# EAGLE schematic BeJeweled-v10 (EAGLE 5.04)

## Sheet 1 of 4
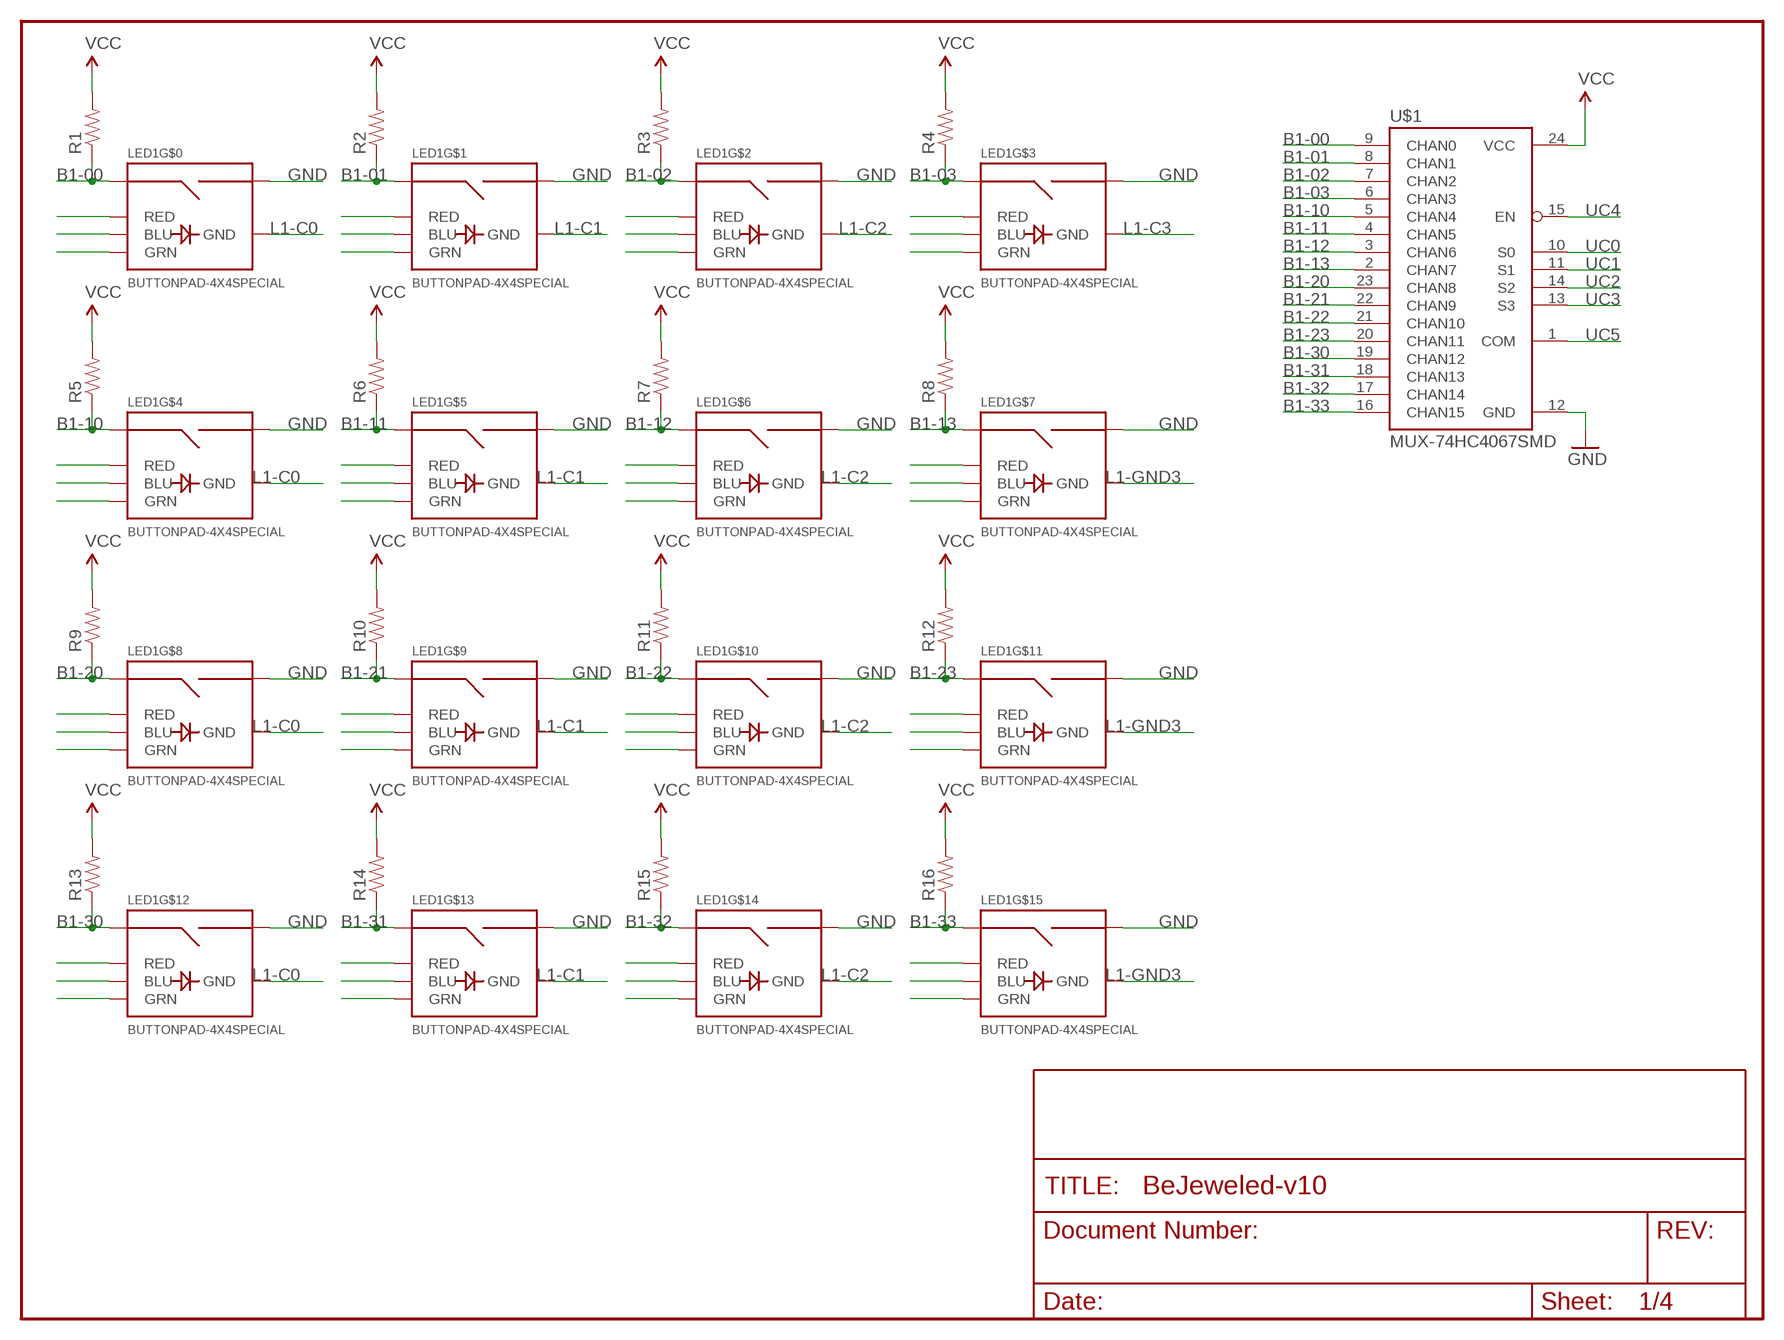
[diagram p0: schematic, sheet 1]

### Parts
LED1  BUTTONPAD-4X4SPECIAL  [BUTTONPAD-4X4-SPECIAL]
R1  RESISTOR0603-RES  [0603-RES]
R2  RESISTOR0603-RES  [0603-RES]
R3  RESISTOR0603-RES  [0603-RES]
R4  RESISTOR0603-RES  [0603-RES]
R5  RESISTOR0603-RES  [0603-RES]
R6  RESISTOR0603-RES  [0603-RES]
R7  RESISTOR0603-RES  [0603-RES]
R8  RESISTOR0603-RES  [0603-RES]
R9  RESISTOR0603-RES  [0603-RES]
R10  RESISTOR0603-RES  [0603-RES]
R11  RESISTOR0603-RES  [0603-RES]
R12  RESISTOR0603-RES  [0603-RES]
R13  RESISTOR0603-RES  [0603-RES]
R14  RESISTOR0603-RES  [0603-RES]
R15  RESISTOR0603-RES  [0603-RES]
R16  RESISTOR0603-RES  [0603-RES]
U$1  MUX-74HC4067SMD  [SSOP24]

### Nets
B1-00: LED1.SIG0(SIG1) R1.1 U$1.9(CHAN0)
B1-01: LED1.SIG2(SIG1) R2.1 U$1.8(CHAN1)
B1-02: LED1.SIG4(SIG1) R3.1 U$1.7(CHAN2)
B1-03: LED1.SIG6(SIG1) R4.1 U$1.6(CHAN3)
B1-10: LED1.SIG8(SIG1) R5.1 U$1.5(CHAN4)
B1-11: LED1.SIG10(SIG1) R6.1 U$1.4(CHAN5)
B1-12: LED1.SIG12(SIG1) R7.1 U$1.3(CHAN6)
B1-13: LED1.SIG14(SIG1) R8.1 U$1.2(CHAN7)
B1-20: LED1.SIG16(SIG1) R9.1 U$1.23(CHAN8)
B1-21: LED1.SIG18(SIG1) R10.1 U$1.22(CHAN9)
B1-22: LED1.SIG20(SIG1) R11.1 U$1.21(CHAN10)
B1-23: LED1.SIG22(SIG1) R12.1 U$1.20(CHAN11)
B1-30: LED1.SIG24(SIG1) R13.1 U$1.19(CHAN12)
B1-31: LED1.SIG26(SIG1) R14.1 U$1.18(CHAN13)
B1-32: LED1.SIG28(SIG1) R15.1 U$1.17(CHAN14)
B1-33: LED1.SIG30(SIG1) R16.1 U$1.16(CHAN15)
GND: LED1.SIG1(SIG2) LED1.SIG3(SIG2) LED1.SIG5(SIG2) LED1.SIG7(SIG2) LED1.SIG9(SIG2) LED1.SIG11(SIG2) LED1.SIG13(SIG2) LED1.SIG15(SIG2) LED1.SIG17(SIG2) LED1.SIG19(SIG2) LED1.SIG21(SIG2) LED1.SIG23(SIG2) LED1.SIG25(SIG2) LED1.SIG27(SIG2) LED1.SIG29(SIG2) LED1.SIG31(SIG2) U$1.12(GND)
L1-C0: LED1.GND0(GND) LED1.GND4(GND) LED1.GND8(GND) LED1.GND12(GND)
L1-C1: LED1.GND1(GND) LED1.GND5(GND) LED1.GND9(GND) LED1.GND13(GND)
L1-C2: LED1.GND2(GND) LED1.GND6(GND) LED1.GND10(GND) LED1.GND14(GND)
L1-C3: LED1.GND3(GND)
L1-GND3: LED1.GND7(GND) LED1.GND11(GND) LED1.GND15(GND)
N$2: LED1.RED0(RED)
N$3: LED1.BLU0(BLU)
N$4: LED1.GRN0(GRN)
N$8: LED1.RED1(RED)
N$9: LED1.BLU1(BLU)
N$10: LED1.GRN1(GRN)
N$14: LED1.RED2(RED)
N$15: LED1.BLU2(BLU)
N$16: LED1.GRN2(GRN)
N$20: LED1.RED3(RED)
N$21: LED1.BLU3(BLU)
N$22: LED1.GRN3(GRN)
N$50: LED1.RED4(RED)
N$51: LED1.BLU4(BLU)
N$52: LED1.GRN4(GRN)
N$54: LED1.RED8(RED)
N$55: LED1.BLU8(BLU)
N$56: LED1.GRN8(GRN)
N$58: LED1.RED12(RED)
N$59: LED1.BLU12(BLU)
N$60: LED1.GRN12(GRN)
N$62: LED1.RED5(RED)
N$63: LED1.BLU5(BLU)
N$64: LED1.GRN6(GRN)
N$66: LED1.RED9(RED)
N$67: LED1.BLU9(BLU)
N$68: LED1.GRN9(GRN)
N$70: LED1.RED13(RED)
N$71: LED1.BLU13(BLU)
N$72: LED1.GRN13(GRN)
N$74: LED1.RED6(RED)
N$75: LED1.BLU6(BLU)
N$76: LED1.GRN5(GRN)
N$78: LED1.RED10(RED)
N$79: LED1.BLU10(BLU)
N$80: LED1.GRN10(GRN)
N$82: LED1.RED14(RED)
N$83: LED1.BLU14(BLU)
N$84: LED1.GRN14(GRN)
N$86: LED1.RED7(RED)
N$87: LED1.BLU7(BLU)
N$88: LED1.GRN7(GRN)
N$90: LED1.RED11(RED)
N$91: LED1.BLU11(BLU)
N$92: LED1.GRN11(GRN)
N$94: LED1.RED15(RED)
N$95: LED1.BLU15(BLU)
N$96: LED1.GRN15(GRN)
UC0: U$1.10(S0)
UC1: U$1.11(S1)
UC2: U$1.14(S2)
UC3: U$1.13(S3)
UC4: U$1.15(EN)
UC5: U$1.1(COM)
VCC: R1.2 R2.2 R3.2 R4.2 R5.2 R6.2 R7.2 R8.2 R9.2 R10.2 R11.2 R12.2 R13.2 R14.2 R15.2 R16.2 U$1.24(VCC)

## Sheet 2 of 4
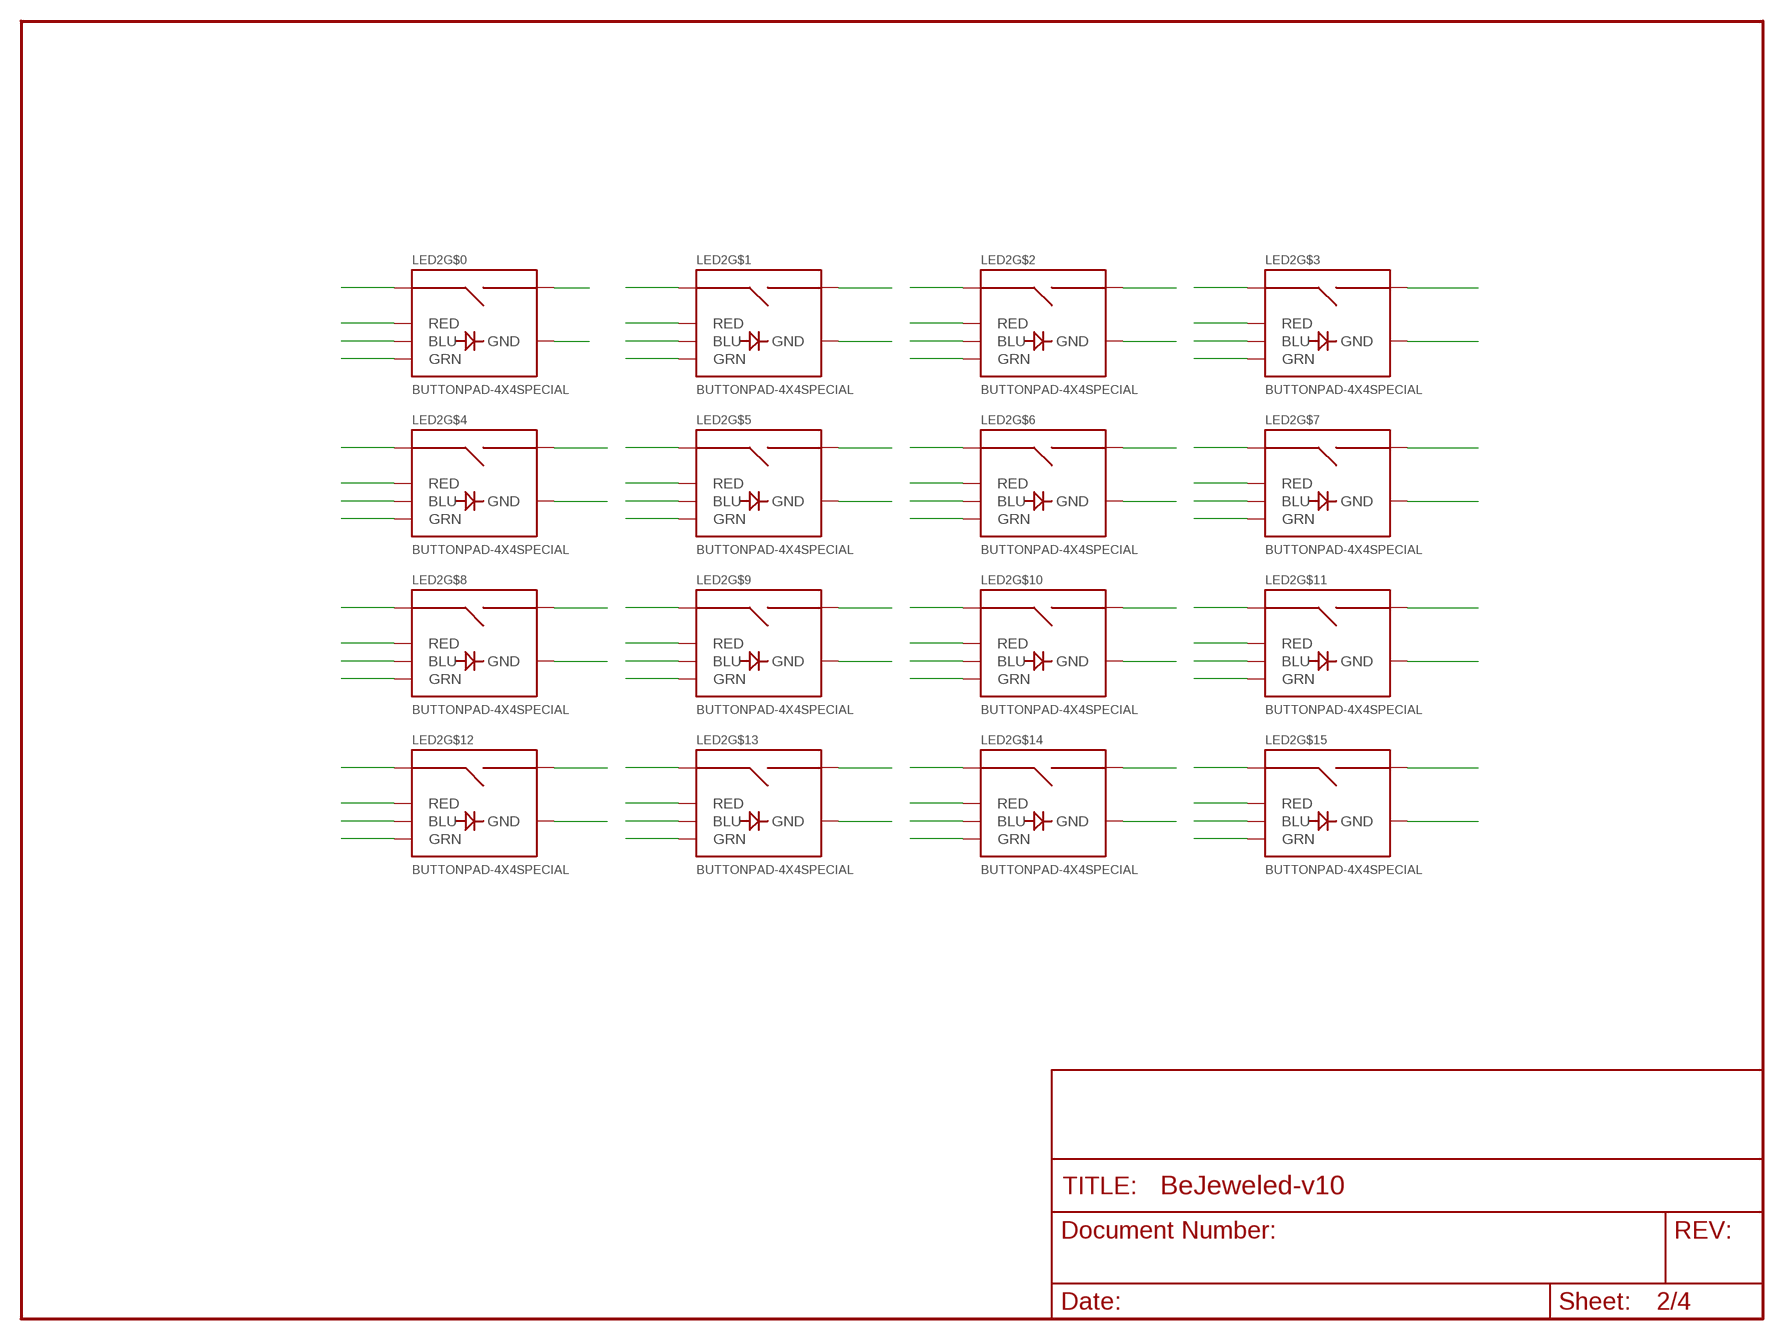
[diagram p1: schematic, sheet 2]

### Parts
LED2  BUTTONPAD-4X4SPECIAL  [BUTTONPAD-4X4-SPECIAL]

### Nets
N$97: LED2.SIG0(SIG1)
N$98: LED2.RED0(RED)
N$99: LED2.BLU0(BLU)
N$100: LED2.GRN0(GRN)
N$101: LED2.SIG1(SIG2)
N$102: LED2.GND0(GND)
N$103: LED2.SIG2(SIG1)
N$104: LED2.RED1(RED)
N$105: LED2.BLU1(BLU)
N$106: LED2.GRN1(GRN)
N$107: LED2.SIG3(SIG2)
N$108: LED2.GND1(GND)
N$109: LED2.SIG4(SIG1)
N$110: LED2.RED2(RED)
N$111: LED2.BLU2(BLU)
N$112: LED2.GRN2(GRN)
N$113: LED2.SIG5(SIG2)
N$114: LED2.GND2(GND)
N$115: LED2.SIG6(SIG1)
N$116: LED2.RED3(RED)
N$117: LED2.BLU3(BLU)
N$118: LED2.GRN3(GRN)
N$119: LED2.SIG7(SIG2)
N$120: LED2.GND3(GND)
N$121: LED2.SIG15(SIG2)
N$122: LED2.GND7(GND)
N$123: LED2.SIG23(SIG2)
N$124: LED2.GND11(GND)
N$125: LED2.SIG31(SIG2)
N$126: LED2.GND15(GND)
N$127: LED2.SIG13(SIG2)
N$128: LED2.GND6(GND)
N$129: LED2.SIG21(SIG2)
N$130: LED2.GND10(GND)
N$131: LED2.SIG29(SIG2)
N$132: LED2.GND14(GND)
N$133: LED2.SIG11(SIG2)
N$134: LED2.GND5(GND)
N$135: LED2.SIG19(SIG2)
N$136: LED2.GND9(GND)
N$137: LED2.SIG27(SIG2)
N$138: LED2.GND13(GND)
N$139: LED2.SIG9(SIG2)
N$140: LED2.GND4(GND)
N$141: LED2.SIG17(SIG2)
N$142: LED2.GND8(GND)
N$143: LED2.SIG25(SIG2)
N$144: LED2.GND12(GND)
N$145: LED2.SIG8(SIG1)
N$146: LED2.RED4(RED)
N$147: LED2.BLU4(BLU)
N$148: LED2.GRN4(GRN)
N$149: LED2.SIG16(SIG1)
N$150: LED2.RED8(RED)
N$151: LED2.BLU8(BLU)
N$152: LED2.GRN8(GRN)
N$153: LED2.SIG24(SIG1)
N$154: LED2.RED12(RED)
N$155: LED2.BLU12(BLU)
N$156: LED2.GRN12(GRN)
N$157: LED2.SIG10(SIG1)
N$158: LED2.RED5(RED)
N$159: LED2.BLU5(BLU)
N$160: LED2.GRN6(GRN)
N$161: LED2.SIG18(SIG1)
N$162: LED2.RED9(RED)
N$163: LED2.BLU9(BLU)
N$164: LED2.GRN9(GRN)
N$165: LED2.SIG26(SIG1)
N$166: LED2.RED13(RED)
N$167: LED2.BLU13(BLU)
N$168: LED2.GRN13(GRN)
N$169: LED2.SIG12(SIG1)
N$170: LED2.RED6(RED)
N$171: LED2.BLU6(BLU)
N$172: LED2.GRN5(GRN)
N$173: LED2.SIG20(SIG1)
N$174: LED2.RED10(RED)
N$175: LED2.BLU10(BLU)
N$176: LED2.GRN10(GRN)
N$177: LED2.SIG28(SIG1)
N$178: LED2.RED14(RED)
N$179: LED2.BLU14(BLU)
N$180: LED2.GRN14(GRN)
N$181: LED2.SIG14(SIG1)
N$182: LED2.RED7(RED)
N$183: LED2.BLU7(BLU)
N$184: LED2.GRN7(GRN)
N$185: LED2.SIG22(SIG1)
N$186: LED2.RED11(RED)
N$187: LED2.BLU11(BLU)
N$188: LED2.GRN11(GRN)
N$189: LED2.SIG30(SIG1)
N$190: LED2.RED15(RED)
N$191: LED2.BLU15(BLU)
N$192: LED2.GRN15(GRN)

## Sheet 3 of 4
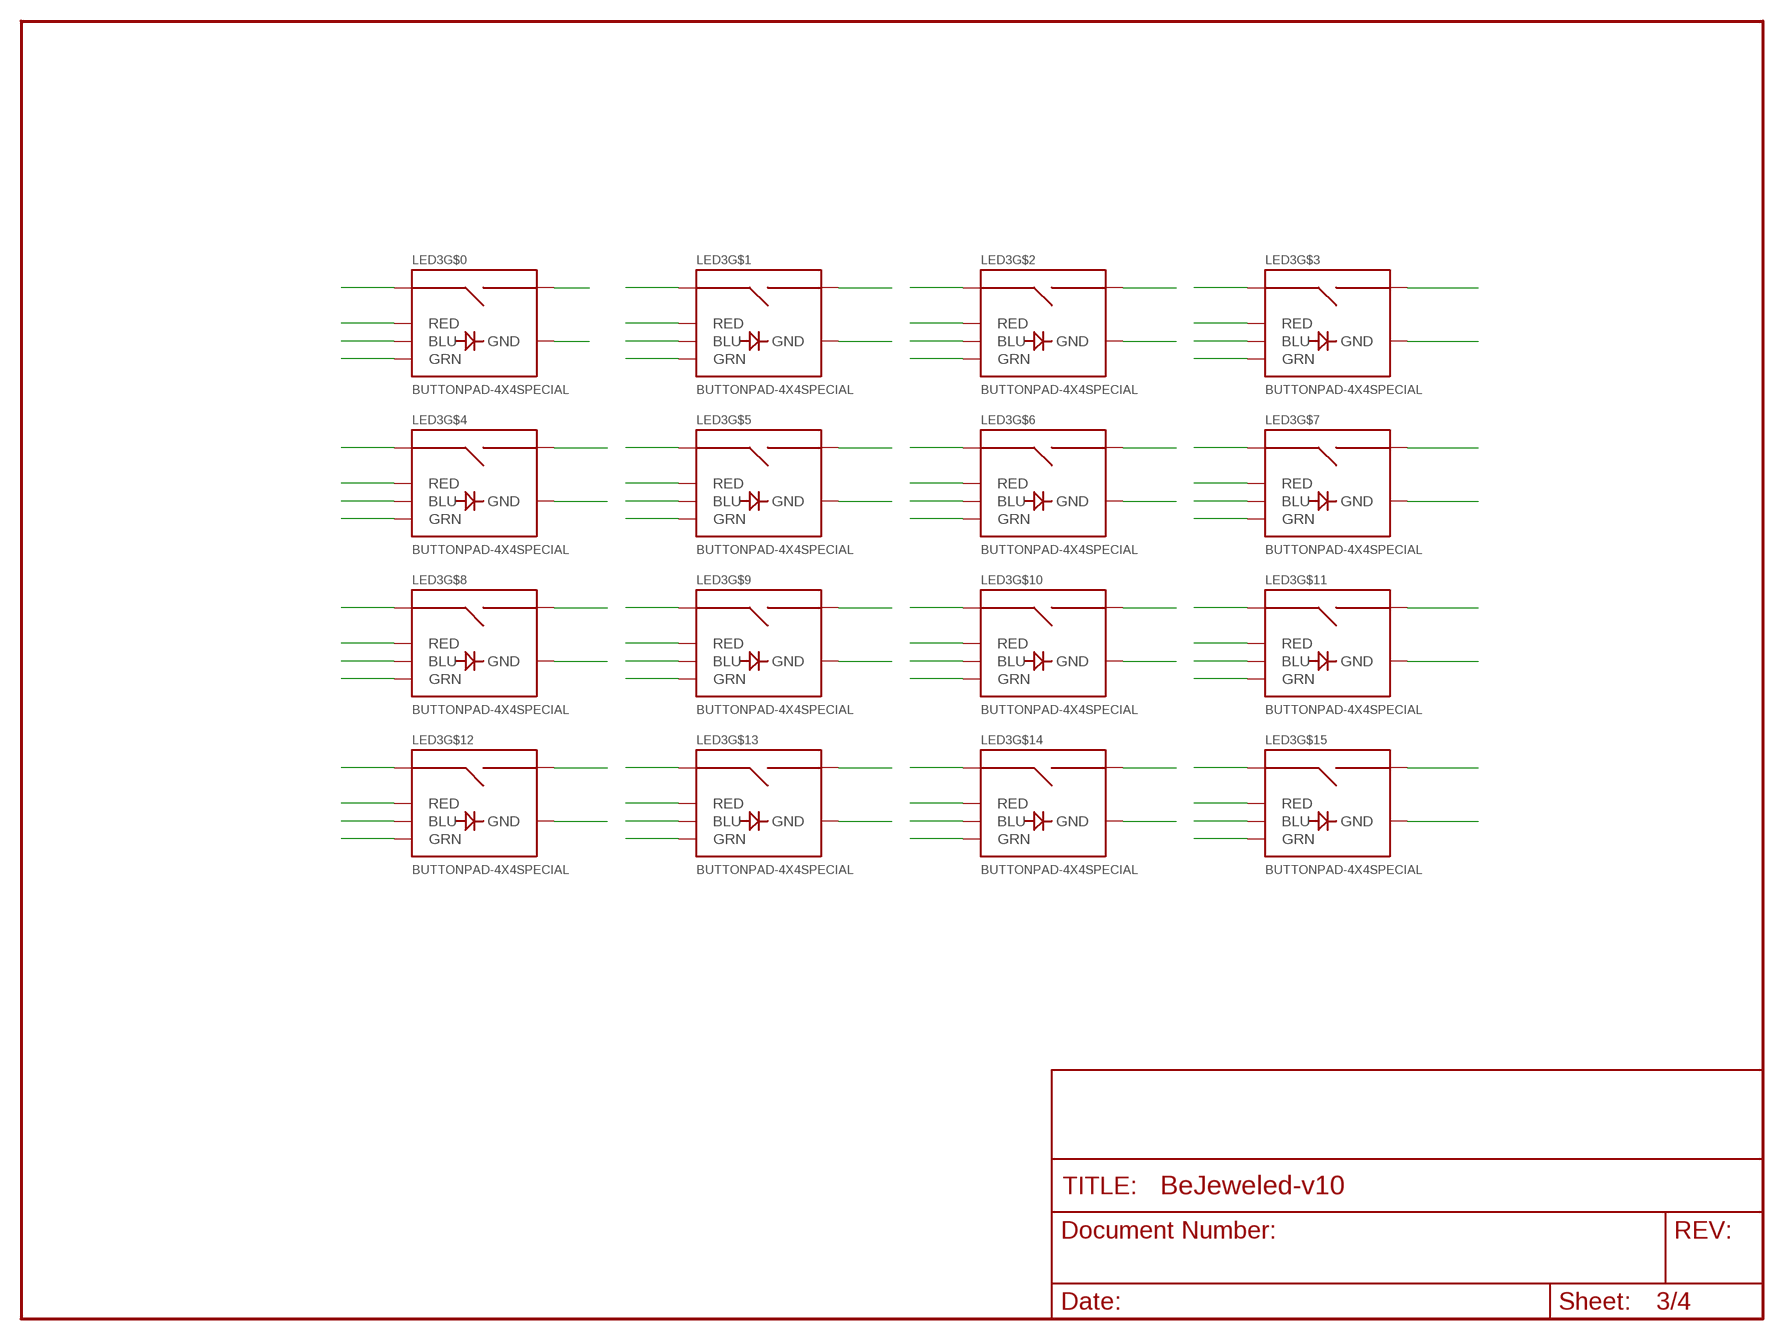
[diagram p2: schematic, sheet 3]

### Parts
LED3  BUTTONPAD-4X4SPECIAL  [BUTTONPAD-4X4-SPECIAL]

### Nets
N$193: LED3.SIG0(SIG1)
N$194: LED3.RED0(RED)
N$195: LED3.BLU0(BLU)
N$196: LED3.GRN0(GRN)
N$197: LED3.SIG1(SIG2)
N$198: LED3.GND0(GND)
N$199: LED3.SIG2(SIG1)
N$200: LED3.RED1(RED)
N$201: LED3.BLU1(BLU)
N$202: LED3.GRN1(GRN)
N$203: LED3.SIG3(SIG2)
N$204: LED3.GND1(GND)
N$205: LED3.SIG4(SIG1)
N$206: LED3.RED2(RED)
N$207: LED3.BLU2(BLU)
N$208: LED3.GRN2(GRN)
N$209: LED3.SIG5(SIG2)
N$210: LED3.GND2(GND)
N$211: LED3.SIG6(SIG1)
N$212: LED3.RED3(RED)
N$213: LED3.BLU3(BLU)
N$214: LED3.GRN3(GRN)
N$215: LED3.SIG7(SIG2)
N$216: LED3.GND3(GND)
N$217: LED3.SIG15(SIG2)
N$218: LED3.GND7(GND)
N$219: LED3.SIG23(SIG2)
N$220: LED3.GND11(GND)
N$221: LED3.SIG31(SIG2)
N$222: LED3.GND15(GND)
N$223: LED3.SIG13(SIG2)
N$224: LED3.GND6(GND)
N$225: LED3.SIG21(SIG2)
N$226: LED3.GND10(GND)
N$227: LED3.SIG29(SIG2)
N$228: LED3.GND14(GND)
N$229: LED3.SIG11(SIG2)
N$230: LED3.GND5(GND)
N$231: LED3.SIG19(SIG2)
N$232: LED3.GND9(GND)
N$233: LED3.SIG27(SIG2)
N$234: LED3.GND13(GND)
N$235: LED3.SIG9(SIG2)
N$236: LED3.GND4(GND)
N$237: LED3.SIG17(SIG2)
N$238: LED3.GND8(GND)
N$239: LED3.SIG25(SIG2)
N$240: LED3.GND12(GND)
N$241: LED3.SIG8(SIG1)
N$242: LED3.RED4(RED)
N$243: LED3.BLU4(BLU)
N$244: LED3.GRN4(GRN)
N$245: LED3.SIG16(SIG1)
N$246: LED3.RED8(RED)
N$247: LED3.BLU8(BLU)
N$248: LED3.GRN8(GRN)
N$249: LED3.SIG24(SIG1)
N$250: LED3.RED12(RED)
N$251: LED3.BLU12(BLU)
N$252: LED3.GRN12(GRN)
N$253: LED3.SIG10(SIG1)
N$254: LED3.RED5(RED)
N$255: LED3.BLU5(BLU)
N$256: LED3.GRN6(GRN)
N$257: LED3.SIG18(SIG1)
N$258: LED3.RED9(RED)
N$259: LED3.BLU9(BLU)
N$260: LED3.GRN9(GRN)
N$261: LED3.SIG26(SIG1)
N$262: LED3.RED13(RED)
N$263: LED3.BLU13(BLU)
N$264: LED3.GRN13(GRN)
N$265: LED3.SIG12(SIG1)
N$266: LED3.RED6(RED)
N$267: LED3.BLU6(BLU)
N$268: LED3.GRN5(GRN)
N$269: LED3.SIG20(SIG1)
N$270: LED3.RED10(RED)
N$271: LED3.BLU10(BLU)
N$272: LED3.GRN10(GRN)
N$273: LED3.SIG28(SIG1)
N$274: LED3.RED14(RED)
N$275: LED3.BLU14(BLU)
N$276: LED3.GRN14(GRN)
N$277: LED3.SIG14(SIG1)
N$278: LED3.RED7(RED)
N$279: LED3.BLU7(BLU)
N$280: LED3.GRN7(GRN)
N$281: LED3.SIG22(SIG1)
N$282: LED3.RED11(RED)
N$283: LED3.BLU11(BLU)
N$284: LED3.GRN11(GRN)
N$285: LED3.SIG30(SIG1)
N$286: LED3.RED15(RED)
N$287: LED3.BLU15(BLU)
N$288: LED3.GRN15(GRN)

## Sheet 4 of 4
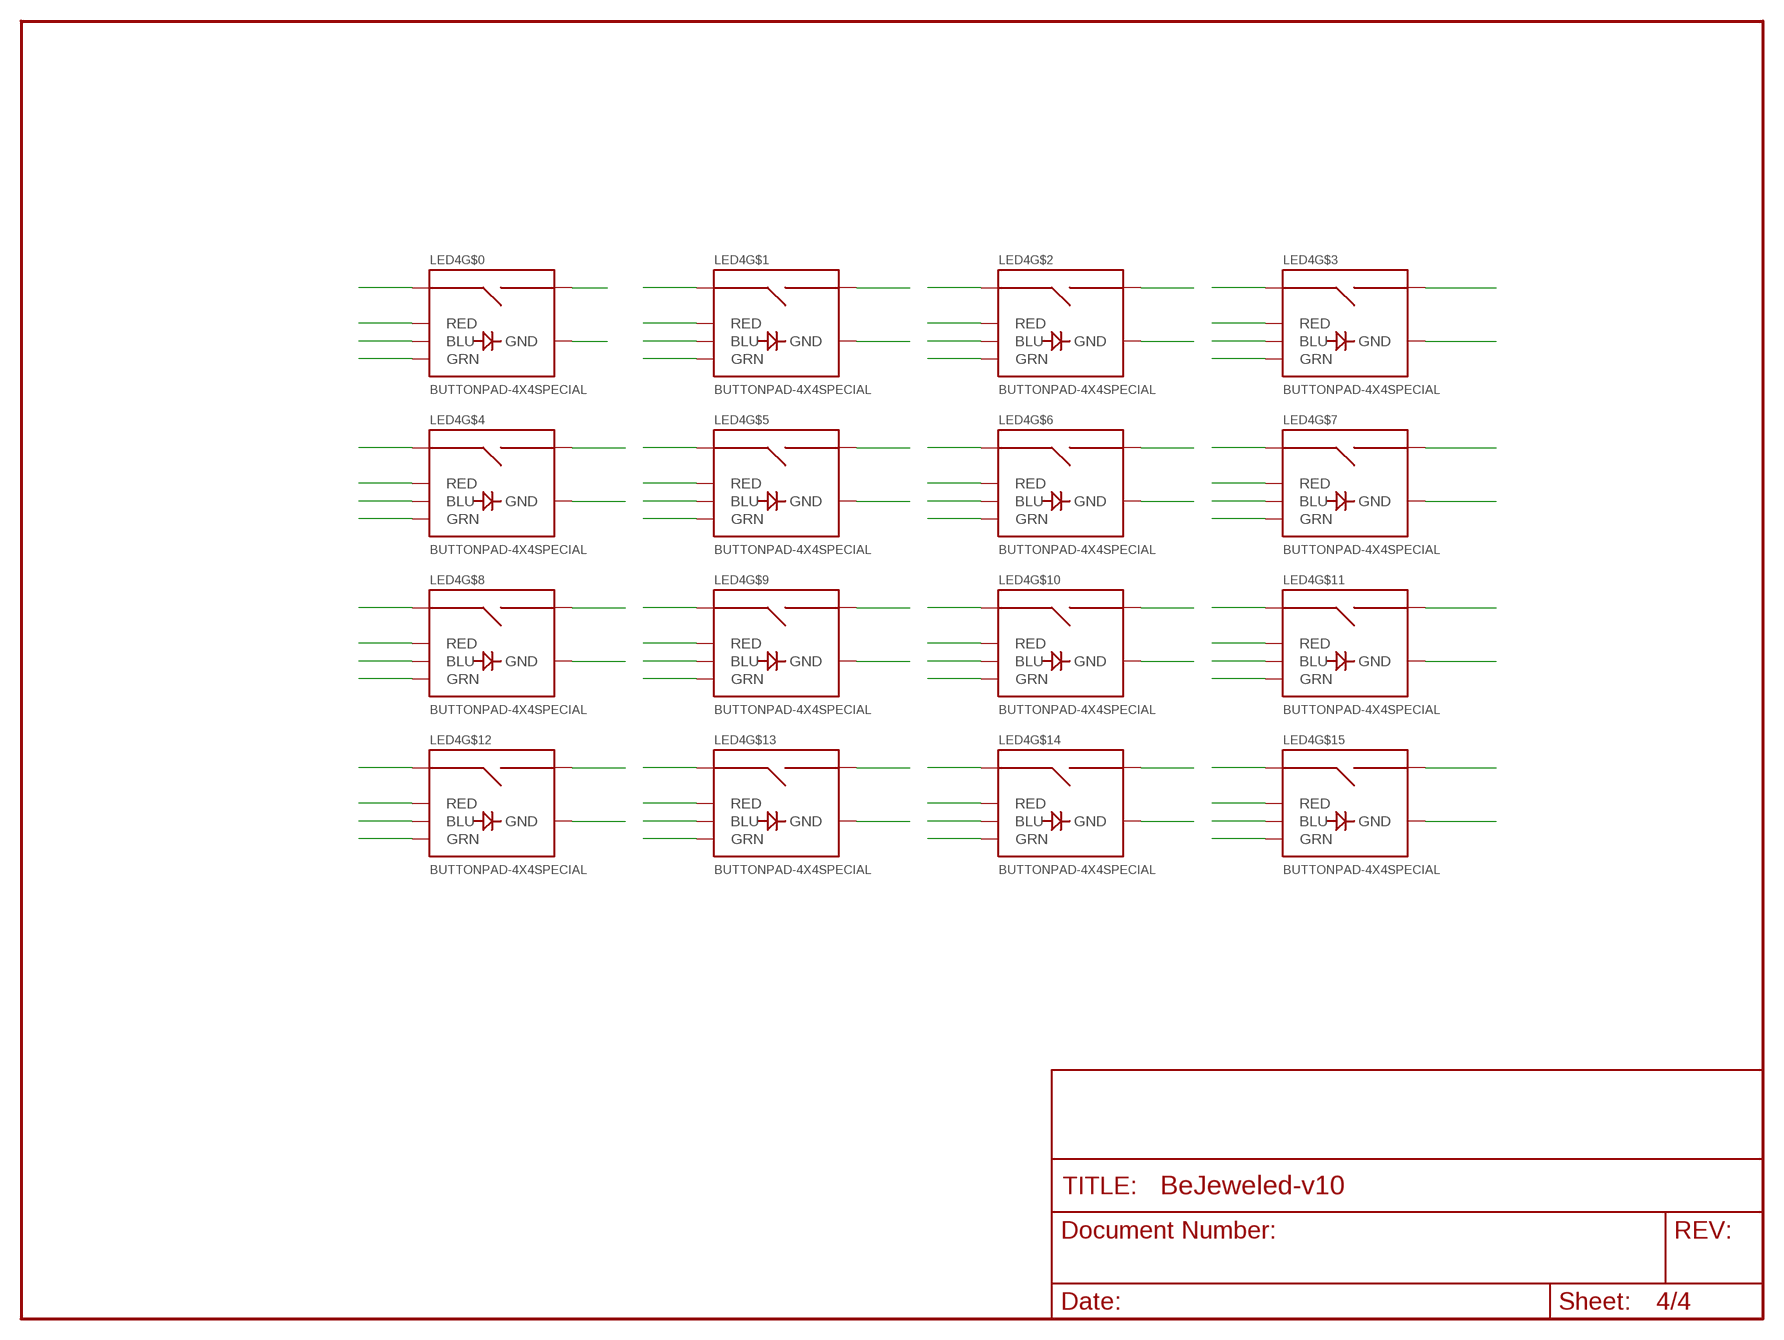
[diagram p3: schematic, sheet 4]

### Parts
LED4  BUTTONPAD-4X4SPECIAL  [BUTTONPAD-4X4-SPECIAL]

### Nets
N$289: LED4.SIG0(SIG1)
N$290: LED4.RED0(RED)
N$291: LED4.BLU0(BLU)
N$292: LED4.GRN0(GRN)
N$293: LED4.SIG1(SIG2)
N$294: LED4.GND0(GND)
N$295: LED4.SIG2(SIG1)
N$296: LED4.RED1(RED)
N$297: LED4.BLU1(BLU)
N$298: LED4.GRN1(GRN)
N$299: LED4.SIG3(SIG2)
N$300: LED4.GND1(GND)
N$301: LED4.SIG4(SIG1)
N$302: LED4.RED2(RED)
N$303: LED4.BLU2(BLU)
N$304: LED4.GRN2(GRN)
N$305: LED4.SIG5(SIG2)
N$306: LED4.GND2(GND)
N$307: LED4.SIG6(SIG1)
N$308: LED4.RED3(RED)
N$309: LED4.BLU3(BLU)
N$310: LED4.GRN3(GRN)
N$311: LED4.SIG7(SIG2)
N$312: LED4.GND3(GND)
N$313: LED4.SIG15(SIG2)
N$314: LED4.GND7(GND)
N$315: LED4.SIG23(SIG2)
N$316: LED4.GND11(GND)
N$317: LED4.SIG31(SIG2)
N$318: LED4.GND15(GND)
N$319: LED4.SIG13(SIG2)
N$320: LED4.GND6(GND)
N$321: LED4.SIG21(SIG2)
N$322: LED4.GND10(GND)
N$323: LED4.SIG29(SIG2)
N$324: LED4.GND14(GND)
N$325: LED4.SIG11(SIG2)
N$326: LED4.GND5(GND)
N$327: LED4.SIG19(SIG2)
N$328: LED4.GND9(GND)
N$329: LED4.SIG27(SIG2)
N$330: LED4.GND13(GND)
N$331: LED4.SIG9(SIG2)
N$332: LED4.GND4(GND)
N$333: LED4.SIG17(SIG2)
N$334: LED4.GND8(GND)
N$335: LED4.SIG25(SIG2)
N$336: LED4.GND12(GND)
N$337: LED4.SIG8(SIG1)
N$338: LED4.RED4(RED)
N$339: LED4.BLU4(BLU)
N$340: LED4.GRN4(GRN)
N$341: LED4.SIG16(SIG1)
N$342: LED4.RED8(RED)
N$343: LED4.BLU8(BLU)
N$344: LED4.GRN8(GRN)
N$345: LED4.SIG24(SIG1)
N$346: LED4.RED12(RED)
N$347: LED4.BLU12(BLU)
N$348: LED4.GRN12(GRN)
N$349: LED4.SIG10(SIG1)
N$350: LED4.RED5(RED)
N$351: LED4.BLU5(BLU)
N$352: LED4.GRN6(GRN)
N$353: LED4.SIG18(SIG1)
N$354: LED4.RED9(RED)
N$355: LED4.BLU9(BLU)
N$356: LED4.GRN9(GRN)
N$357: LED4.SIG26(SIG1)
N$358: LED4.RED13(RED)
N$359: LED4.BLU13(BLU)
N$360: LED4.GRN13(GRN)
N$361: LED4.SIG12(SIG1)
N$362: LED4.RED6(RED)
N$363: LED4.BLU6(BLU)
N$364: LED4.GRN5(GRN)
N$365: LED4.SIG20(SIG1)
N$366: LED4.RED10(RED)
N$367: LED4.BLU10(BLU)
N$368: LED4.GRN10(GRN)
N$369: LED4.SIG28(SIG1)
N$370: LED4.RED14(RED)
N$371: LED4.BLU14(BLU)
N$372: LED4.GRN14(GRN)
N$373: LED4.SIG14(SIG1)
N$374: LED4.RED7(RED)
N$375: LED4.BLU7(BLU)
N$376: LED4.GRN7(GRN)
N$377: LED4.SIG22(SIG1)
N$378: LED4.RED11(RED)
N$379: LED4.BLU11(BLU)
N$380: LED4.GRN11(GRN)
N$381: LED4.SIG30(SIG1)
N$382: LED4.RED15(RED)
N$383: LED4.BLU15(BLU)
N$384: LED4.GRN15(GRN)

## Library data of the parts
LED1-LED4 = SparkFun:BUTTONPAD-4X4: 5mm Button Pad Proto layout and schematic for 4x4 button pad. Spark Fun Electronics SKU : COM-07835. Compatible common cathode tri-color LED SKU : COM-00105
R1-R16 = SparkFun:RESISTOR: Resistor Basic schematic elements and footprints for 0603, 1206, and PTH 1/10th watt (small) resistors.
U$1 = SparkFun:MUX-74HC4067